# Altium schematic sheet PLD_Thermometers_PT1000_interface.SchDoc: Thermometers
size A4; SheetTotal: 32
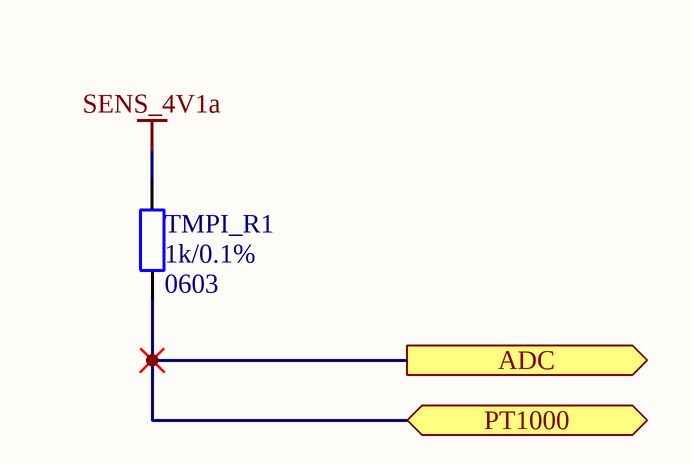
[diagram p0: PLD_Thermometers_PT1000_interface.SchDoc]

## Parts
TMPI_R1  Package: 0603  [SMD_Resistor_0603]  (hidden comment: 1k/0.1%)

## Ports
ADC (out), PT1000 (bidir)

## Nets
SENS_4V1a: TMPI_R1.2
ADC: TMPI_R1.1 ; port PT1000, port ADC

## Notes on the sheet
- Title:
- Project:
- Author:
- Model:
- Document Number:
- Checked by:
- Rev:
- Date:
- Approved by:
- Sheet:
- of
- File name:

## Library data of the parts
TMPI_R1 = Res: Value: 1k/0.1%